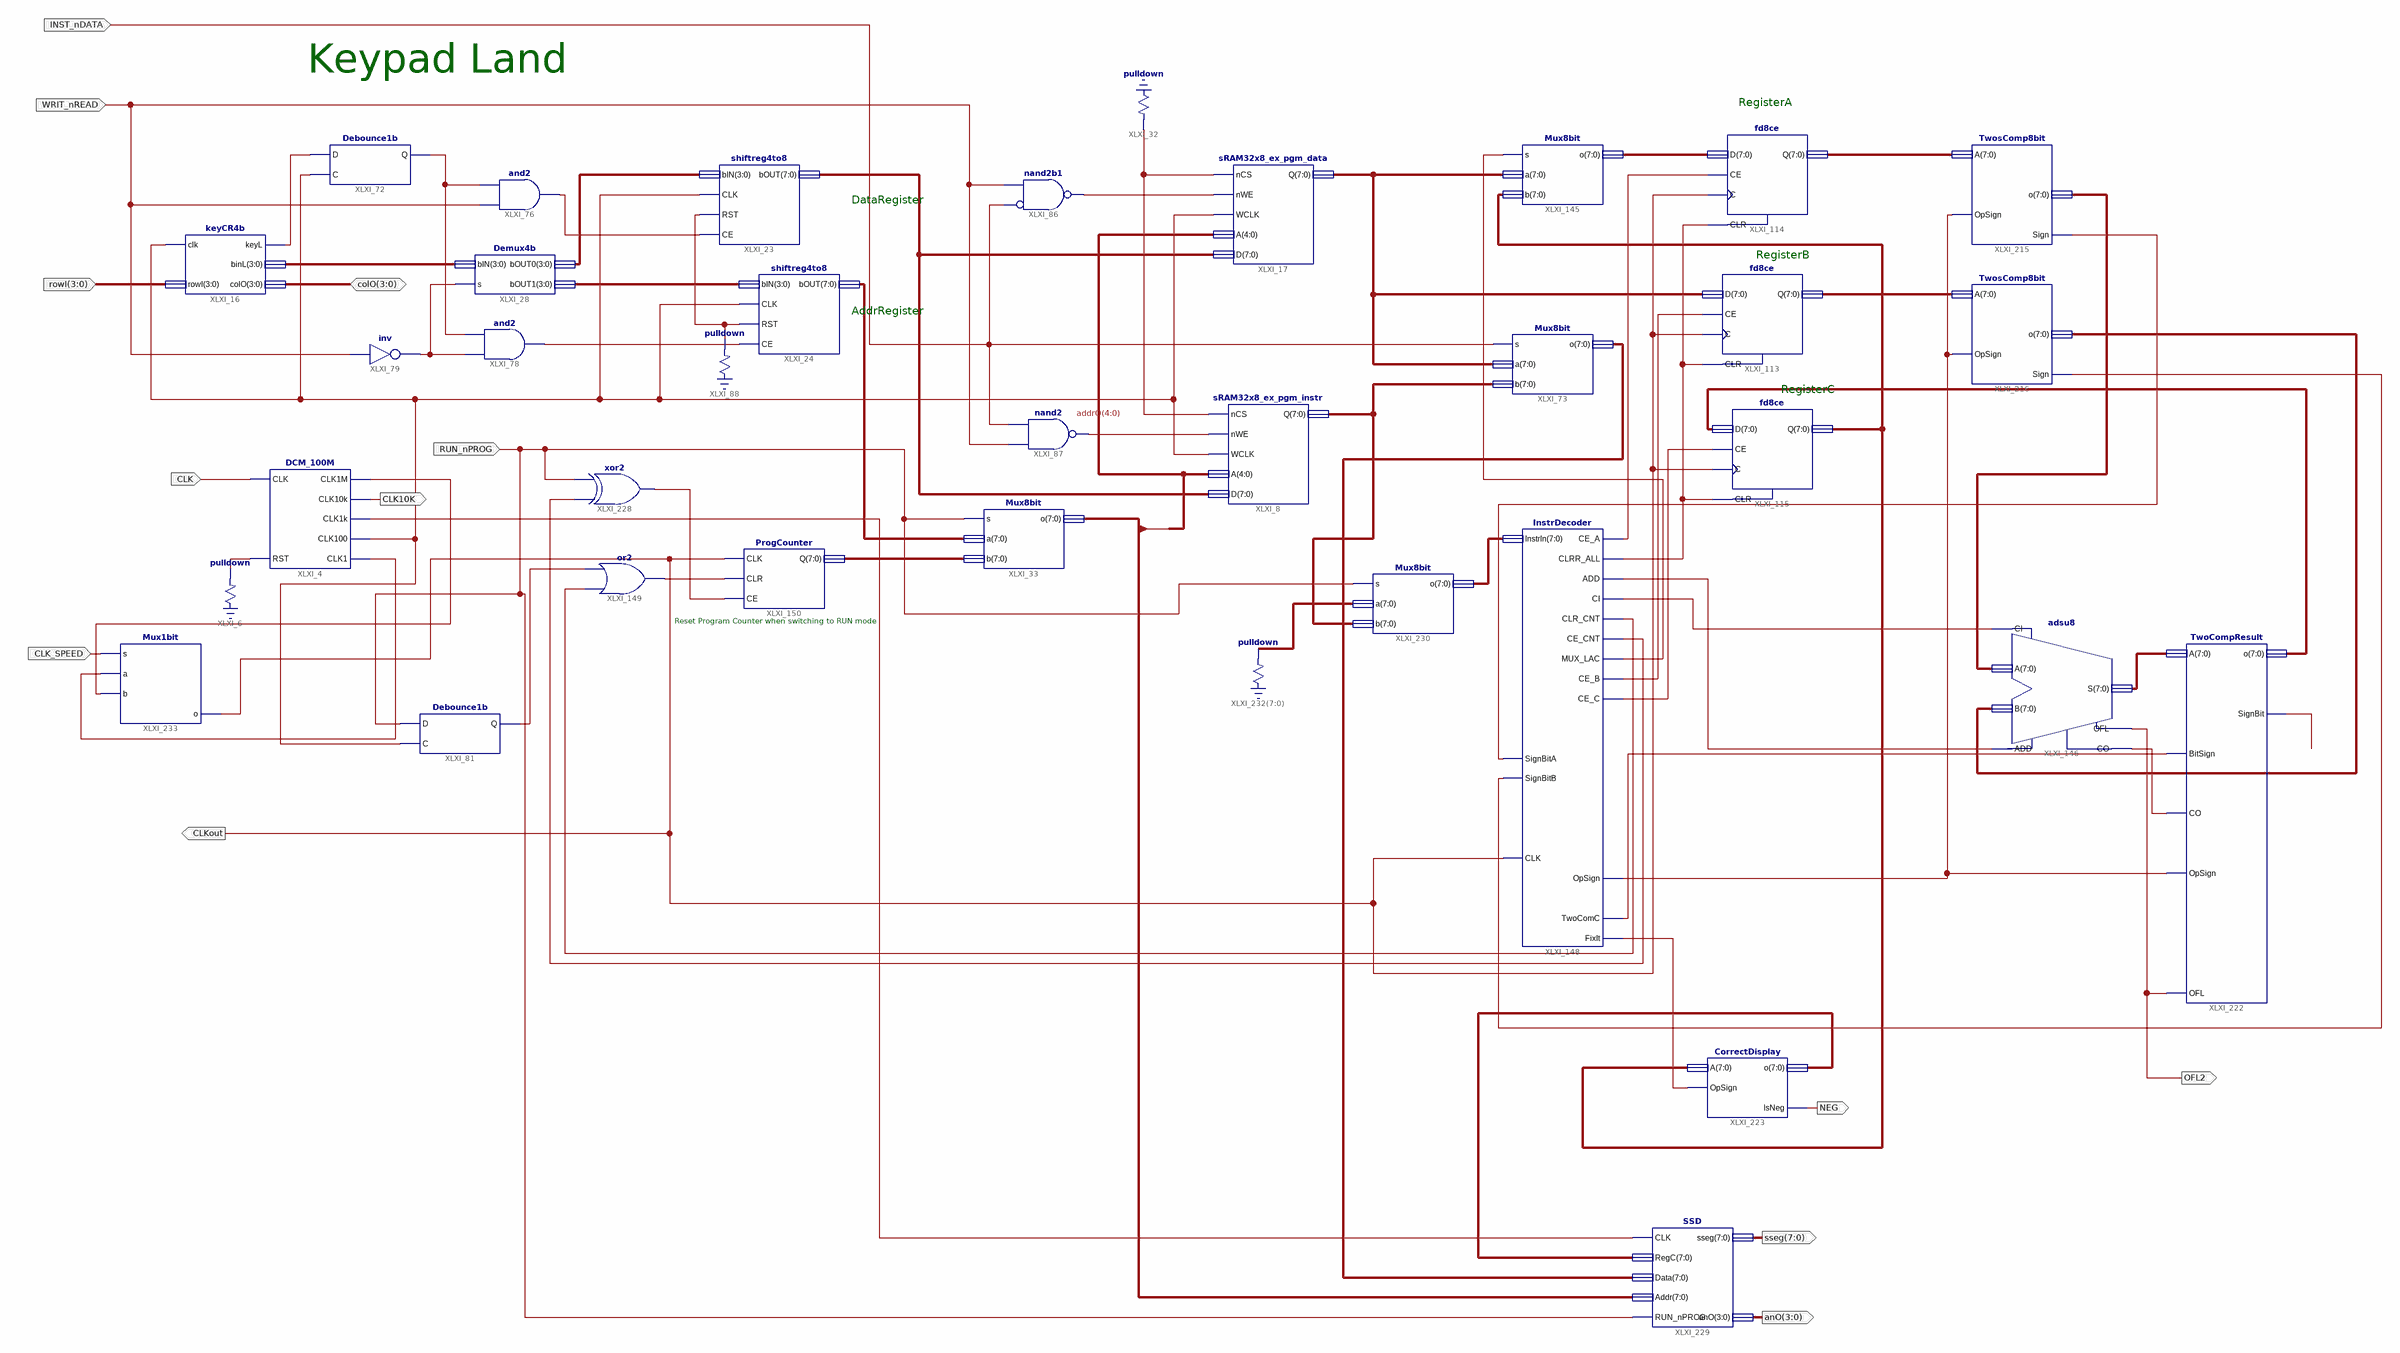
[diagram p0: schematic sheet 1]
// Xilinx ISE schematic FinalProject.sch (spartan3e) as structural Verilog: 36 symbols, 17 ports
module FinalProject (
  input  INST_nDATA,
  input  WRIT_nREAD,
  input  [3:0] rowI,
  input  CLK,
  input  RUN_nPROG,
  input  CLK_SPEED,
  inout  [3:0] colO,
  output [7:0] XLXN_753,
  output XLXN_794,
  output XLXN_803,
  output CLKout,
  output CLK10K,
  output [7:0] sseg,
  output [3:0] anO,
  output NEG,
  output XLXN_1155,
  output OFL2
);

  wire OFL, XLXN_9, XLXN_338, XLXN_362, XLXN_364, XLXN_368, XLXN_387, XLXN_394, XLXN_408, XLXN_437, XLXN_714,
       XLXN_722, XLXN_791, XLXN_795, XLXN_800, XLXN_804, XLXN_811, XLXN_817, XLXN_818, XLXN_826, XLXN_1054,
       XLXN_1057, XLXN_1108, XLXN_1109, XLXN_1122, XLXN_1126, XLXN_1127, XLXN_1128, XLXN_1129, XLXN_1153,
       XLXN_1154;
  wire [3:0] XLXN_117, XLXN_118, XLXN_280;
  wire [7:0] addrOUT, addrQ, XLXN_358, XLXN_380, XLXN_395, XLXN_752, XLXN_767, XLXN_1034, XLXN_1036,
       XLXN_1050, XLXN_1053, XLXN_1096, XLXN_1124, XLXN_1133, XLXN_1137, XLXN_1138, XLXN_1143;

  Debounce1b XLXI_72 (.D(XLXN_362), .C(XLXN_364), .Q(XLXN_368));
  Demux4b XLXI_28 (.bIN(XLXN_117), .s(XLXN_394), .bOUT0(XLXN_118), .bOUT1(XLXN_280));
  keyCR4b XLXI_16 (.clk(XLXN_364), .rowI(rowI), .keyL(XLXN_362), .binL(XLXN_117), .colO(colO));
  not XLXI_79 (XLXN_394, WRIT_nREAD);
  and XLXI_78 (XLXN_338, XLXN_394, XLXN_368);
  and XLXI_76 (XLXN_387, WRIT_nREAD, XLXN_368);
  shiftreg4to8 XLXI_24 (.bIN(XLXN_280), .CLK(XLXN_364), .RST(XLXN_437), .CE(XLXN_338), .bOUT(XLXN_358));
  \pulldown  XLXI_88 (.O(XLXN_437));
  DCM_100M XLXI_4 (
    .CLK(CLK), .RST(XLXN_9), .CLK1M(XLXN_1154), .CLK10k(CLK10K), .CLK1k(XLXN_1129), .CLK100(XLXN_364),
    .CLK1(XLXN_1153));
  \pulldown  XLXI_6 (.O(XLXN_9));
  Mux8bit XLXI_33 (.s(RUN_nPROG), .a(XLXN_358), .b(XLXN_395), .o(addrQ));
  \pulldown  XLXI_32 (.O(XLXN_714));
  or XLXI_149 (XLXN_817, XLXN_1057, XLXN_818);
  ProgCounter XLXI_150 (.CLK(CLKout), .CLR(XLXN_817), .CE(XLXN_826), .Q(XLXN_395));
  Debounce1b XLXI_81 (.D(RUN_nPROG), .C(XLXN_364), .Q(XLXN_818));
  adsu8 XLXI_146 (.A(XLXN_1034), .ADD(XLXN_795), .B(XLXN_1036), .CI(XLXN_800), .CO(OFL), .OFL(OFL2), .S(XLXN_1050));
  shiftreg4to8 XLXI_23 (.bIN(XLXN_118), .CLK(XLXN_364), .RST(XLXN_437), .CE(XLXN_387), .bOUT(addrOUT));
  nand XLXI_86 (XLXN_722, ~INST_nDATA, WRIT_nREAD);  // nand2b1
  nand XLXI_87 (XLXN_408, WRIT_nREAD, INST_nDATA);
  sRAM32x8_ex_pgm_data XLXI_17 (
    .nCS(XLXN_714), .nWE(XLXN_722), .WCLK(XLXN_364), .A(addrQ[4:0]), .D(addrOUT), .Q(XLXN_753));
  sRAM32x8_ex_pgm_instr XLXI_8 (
    .nCS(XLXN_714), .nWE(XLXN_408), .WCLK(XLXN_364), .A(addrQ[4:0]), .D(addrOUT), .Q(XLXN_380));
  Mux8bit XLXI_145 (.s(XLXN_811), .a(XLXN_753), .b(XLXN_1124), .o(XLXN_752));
  Mux8bit XLXI_73 (.s(INST_nDATA), .a(XLXN_753), .b(XLXN_380), .o(XLXN_1137));
  fd8ce XLXI_114 (.C(CLKout), .CE(XLXN_791), .CLR(XLXN_794), .D(XLXN_752), .Q(XLXN_1096));
  fd8ce XLXI_113 (.C(CLKout), .CE(XLXN_803), .CLR(XLXN_794), .D(XLXN_753), .Q(XLXN_767));
  fd8ce XLXI_115 (.C(CLKout), .CE(XLXN_804), .CLR(XLXN_794), .D(XLXN_1053), .Q(XLXN_1124));
  TwosComp8bit XLXI_216 (.A(XLXN_767), .OpSign(XLXN_1126), .o(XLXN_1036), .Sign(XLXN_1109));
  InstrDecoder XLXI_148 (
    .InstrIn(XLXN_1138), .CLK(CLKout), .SignBitA(XLXN_1108), .SignBitB(XLXN_1109), .CE_A(XLXN_791),
    .CLRR_ALL(XLXN_794), .MUX_LAC(XLXN_811), .CE_B(XLXN_803), .CE_C(XLXN_804), .CI(XLXN_800), .ADD(XLXN_795),
    .OpSign(XLXN_1126), .TwoComC(XLXN_1122), .FixIt(XLXN_1128), .CE_CNT(XLXN_1054), .CLR_CNT(XLXN_1057));
  TwosComp8bit XLXI_215 (.A(XLXN_1096), .OpSign(XLXN_1126), .o(XLXN_1034), .Sign(XLXN_1108));
  TwoCompResult XLXI_222 (
    .A(XLXN_1050), .BitSign(XLXN_1122), .CO(OFL), .OpSign(XLXN_1126), .o(XLXN_1053), .SignBit(XLXN_1127),
    .OFL(OFL2));
  CorrectDisplay XLXI_223 (.A(XLXN_1124), .OpSign(XLXN_1128), .o(XLXN_1133), .IsNeg(NEG));
  xor XLXI_228 (XLXN_826, XLXN_1054, RUN_nPROG);
  SSD XLXI_229 (
    .CLK(XLXN_1129), .RegC(XLXN_1133), .Data(XLXN_1137), .Addr(addrQ), .RUN_nPROG(RUN_nPROG), .sseg(sseg),
    .anO(anO));
  Mux8bit XLXI_230 (.s(RUN_nPROG), .a(XLXN_1143), .b(XLXN_380), .o(XLXN_1138));
  \pulldown  XLXI_232[7:0] (.O(XLXN_1143));
  Mux1bit XLXI_233 (.s(CLK_SPEED), .b(XLXN_1154), .a(XLXN_1153), .o(CLKout));

  // Notes on the sheet:
  //   Keypad Land
  //   RegisterA
  //   DataRegister
  //   RegisterB
  //   AddrRegister
  //   RegisterC
  //   Reset Program Counter when switching to RUN mode
endmodule
